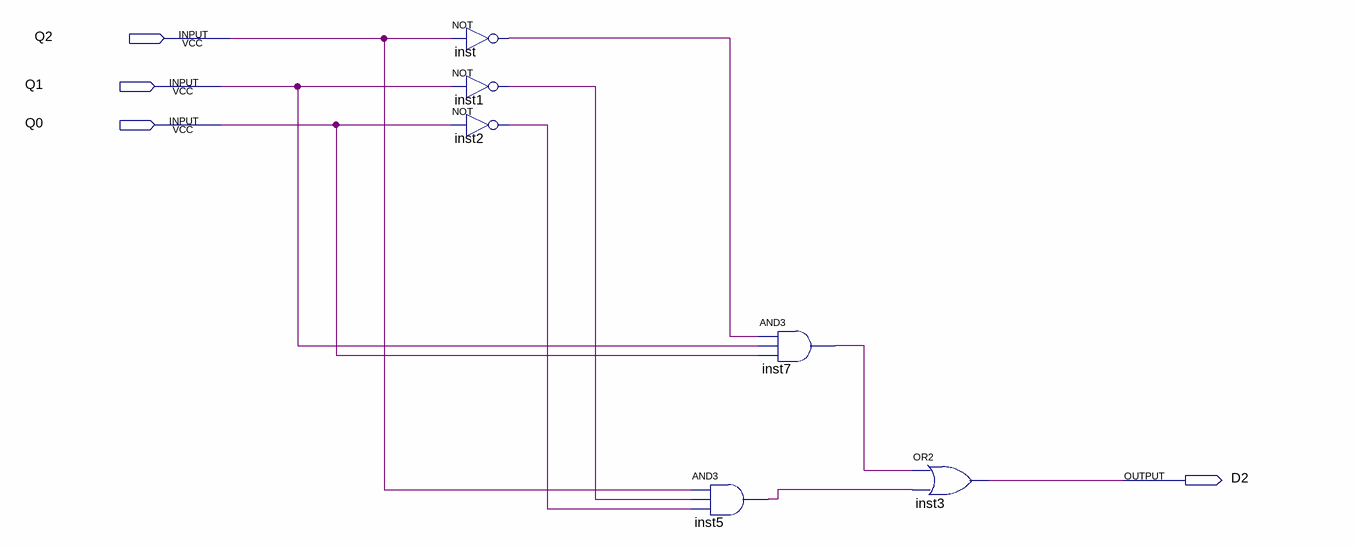
[diagram p0: schematic sheet]
// Quartus schematic D2.bdf as structural Verilog: 6 symbols, 4 pins
module D2 (
  input  Q2,
  input  Q1,
  input  Q0,
  output D2
);

  wire inst1_out, inst2_out, inst5_out, inst7_out, inst_out;

  not inst (inst_out, Q2);
  not inst1 (inst1_out, Q1);
  not inst2 (inst2_out, Q0);
  and inst7 (inst7_out, inst_out, Q1, Q0);
  and inst5 (inst5_out, Q2, inst1_out, inst2_out);
  or inst3 (D2, inst7_out, inst5_out);
endmodule
